# EAGLE design PCB Design (EAGLE 8.6.3)
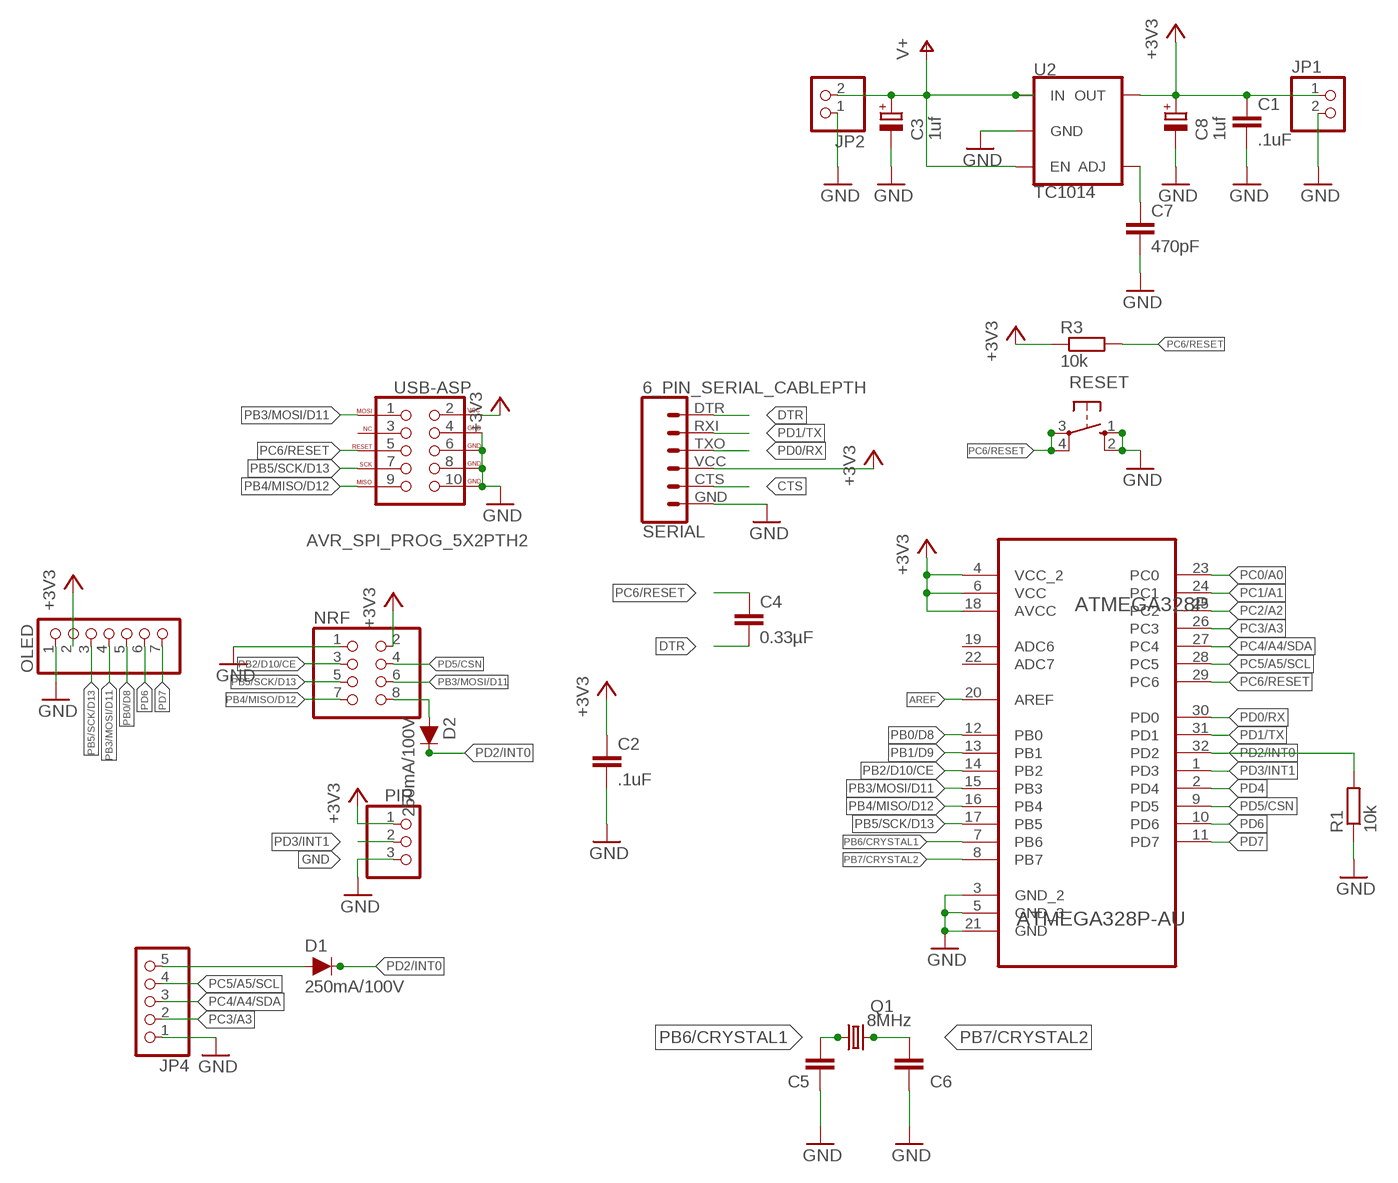
[diagram p0: schematic, sheet 1]

## Parts
ATMEGA328P  ATMEGA328P-AU  [QFP80P900X900X120-32N]
C1  .1uF  C-EUC0805K  [C0805K]
C2  .1uF  C-EUC0805K  [C0805K]
C3  1uf  CPOL-EUE2.5-5  [E2,5-5]
C4  0.33µF  C-EUC0805K  [C0805K]
C5  22pF  C-EUC0805K  [C0805K]
C6  22pF  C-EUC0805K  [C0805K]
C7  470pF  C-EUC0805K  [C0805K]
C8  1uf  CPOL-EUE2.5-5  [E2,5-5]
D1  250mA/100V  DIODE-BAS16J  [SOD-323]
D2  250mA/100V  DIODE-BAS16J  [SOD-323]
JP1  PINHD-1X2  [1X02]
JP2  PINHD-1X2  [1X02]
JP4  PINHD-1X5  [1X05]
NRF  PINHD-2X4  [2X04]
OLED  PINHD-1X7  [1X07]
PIR  PINHD-1X3  [1X03]
Q1  8MHz  CRYSTALHC49U70  [HC49U70]
R1  10k  R-EU_M0805  [M0805]
R3  10k  R-EU_M0805  [M0805]
RESET  10-XX  [B3F-10XX]
SERIAL  6_PIN_SERIAL_CABLEPTH  [FTDI_BASIC]
U2  TC1014  AP2202-ADJ  [SOT23-5]
USB-ASP  AVR_SPI_PROG_5X2PTH2  [2X5-SHROUDED]

## Nets
8: D2.A NRF.8
+3V3: ATMEGA328P.4(VCC_2) ATMEGA328P.6(VCC) ATMEGA328P.18(AVCC) C1.1 C2.1 C8.+ JP1.1 NRF.2 OLED.2 PIR.1 R3.1 SERIAL.VCC U2.5(OUT) USB-ASP.2(VCC)
AREF: ATMEGA328P.20(AREF)
BYPASS: C7.1 U2.4(ADJ)
CTS: SERIAL.CTS
DTR: C4.2 SERIAL.DTR
GND: ATMEGA328P.3(GND_2) ATMEGA328P.5(GND_3) ATMEGA328P.21(GND) C1.2 C2.2 C3.- C5.1 C6.1 C7.2 C8.- JP1.2 JP2.1 JP4.1 NRF.1 OLED.1 PIR.3 R1.1 RESET.1(S) RESET.2(S1) SERIAL.GND U2.2(GND) USB-ASP.4(GND) USB-ASP.6(GND) USB-ASP.8(GND) USB-ASP.10(GND)
N$6: D1.A JP4.5
PB0/D8: ATMEGA328P.12(PB0) OLED.5
PB1/D9: ATMEGA328P.13(PB1)
PB2/D10/CE: ATMEGA328P.14(PB2) NRF.3
PB3/MOSI/D11: ATMEGA328P.15(PB3) NRF.6 OLED.4 USB-ASP.1(MOSI)
PB4/MISO/D12: ATMEGA328P.16(PB4) NRF.7 USB-ASP.9(MISO)
PB5/SCK/D13: ATMEGA328P.17(PB5) NRF.5 OLED.3 USB-ASP.7(SCK)
PB6/CRYSTAL1: ATMEGA328P.7(PB6) C5.2 Q1.1
PB7/CRYSTAL2: ATMEGA328P.8(PB7) C6.2 Q1.2
PC0/A0: ATMEGA328P.23(PC0)
PC1/A1: ATMEGA328P.24(PC1)
PC2/A2: ATMEGA328P.25(PC2)
PC3/A3: ATMEGA328P.26(PC3) JP4.2
PC4/A4/SDA: ATMEGA328P.27(PC4) JP4.3
PC5/A5/SCL: ATMEGA328P.28(PC5) JP4.4
PC6/RESET: ATMEGA328P.29(PC6) C4.1 R3.2 RESET.3(P) RESET.4(P1) USB-ASP.5(RESET)
PD0/RX: ATMEGA328P.30(PD0) SERIAL.TXO
PD1/TX: ATMEGA328P.31(PD1) SERIAL.RXI
PD2/INT0: ATMEGA328P.32(PD2) D1.C D2.C R1.2
PD3/INT1: ATMEGA328P.1(PD3) PIR.2
PD4: ATMEGA328P.2(PD4)
PD5/CSN: ATMEGA328P.9(PD5) NRF.4
PD6: ATMEGA328P.10(PD6) OLED.6
PD7: ATMEGA328P.11(PD7) OLED.7
V+: C3.+ JP2.2 U2.1(IN) U2.3(EN)
Unconnected: ATMEGA328P.19(ADC6) ATMEGA328P.22(ADC7) USB-ASP.3(NC)

## Library data of the parts
ATMEGA328P = Atmel_By_element14_Batch_1-00:ATMEGA328P-AU: 8-bit Microcontroller with In-System Programmable Flash; MF: MICROCHIP; MPN: ATMEGA328P-AU; OC_FARNELL: 1715486; OC_NEWARK: 14R4631; PACKAGE: TQFP-32; SUPPLIER: Atmel
C1 C2 C4-C7 = rcl:C-EU: CAPACITOR, European symbol; OC_FARNELL: unknown; SPICEPREFIX: C
C3 C8 = rcl:CPOL-EU: POLARIZED CAPACITOR, European symbol; OC_FARNELL: unknown; SPICEPREFIX: C
D1 D2 = SparkFun-DiscreteSemi:DIODE: Diode These are standard reverse protection diodes and small signal diodes. SparkFun Products: SparkFun SparkPunk Sound Kit <https://www.sparkfun.com/products/11177> SparkFun ESP8266 Thing <https://www.sparkfun.com/products/13231>; MF: SCHMERSAL; MPN: BNS33-11ZG-3M; OC_FARNELL: 1890445; PROD_ID: DIO-09646
JP1 JP2 = pinhead:PINHD-1X2: PIN HEADER; OC_FARNELL: unknown
JP4 = pinhead:PINHD-1X5: PIN HEADER; OC_FARNELL: unknown
NRF = pinhead:PINHD-2X4: PIN HEADER; OC_FARNELL: unknown
OLED = pinhead:PINHD-1X7: PIN HEADER; OC_FARNELL: unknown
PIR = pinhead:PINHD-1X3: PIN HEADER; OC_FARNELL: unknown
Q1 = crystal:CRYSTAL: CRYSTAL; OC_FARNELL: unknown; OC_NEWARK: unknown
R1 R3 = resistor:R-EU_: RESISTOR, European symbol; OC_FARNELL: unknown
RESET = switch-omron:10-XX: OMRON SWITCH; MF: OMRON ELECTRONIC COMPONENTS; MPN: B3F-1000; OC_FARNELL: 176432; OC_NEWARK: 36M3542
SERIAL = SparkFun-Connectors:6_PIN_SERIAL_CABLE: 6-pin header connection for use with the "FTDI BASIC" pinout - CABLE SIDE. Also known as "Arduino Serial Program Header". This is used on a design to provide a 6-pin connection point for serial communication usually from a USB cable (D+/D-) to these headers (RX/TX). It also has the remaining pins necessary for programming in the Arduino evironment (DTR, GND, and sometimes VCC). Note, this device has "CABLE" in the name. It is intended to be used on a design that usually lives on the end of your USB cable and prvides the converter chip (FTDI232 or FTDI231x) to commnicate serial RX/TX. The "sister" device, named "TARGET" is inteneded to be used on a design that contains a target micro-controller that you wish to program. You can populate with some of these: Female Headers <https://www.sparkfun.com/products/115> (PRT-00115) For reference (or to suit your programming needs) check out these designs: SparkFun FTDI Basic Breakout - 5V <https://www.sparkfun.com/products/9716> (DEV-09716) SparkFun FTDI Basic Breakout - 3.3V <https://www.sparkfun.com/products/9873> (DEV-09873) SparkFun FTDI SmartBasic <https://www.sparkfun.com/products/12935> (DEV-12935) SparkFun Beefy 3 - FTDI Basic Breakout <https://www.sparkfun.com/products/13746> (DEV-13746); OC_FARNELL: unknown
U2 = SparkFun-IC-Power:AP2202-ADJ: AP2202 Adjustable LDO Diodes Inc small, low-cost LDO 150mA, 13.2V, less than 200mV dropout; OC_FARNELL: unknown; PROD_ID: VREG-12189; VALUE: AP2202-ADJ
USB-ASP = SparkFun-Connectors:AVR_SPI_PROG_5X2: AVR 10-pin ICSP Header This is the standard AVR In Circuit Serial Programming header. Minimal, but includes pin one indicator. Works with standard Olimex programmers. SparkFun Products: 2x5 AVR ICSP Male Header <https://www.sparkfun.com/products/778> - PTH 2x5 Pin Shrouded Header <https://www.sparkfun.com/products/8506> - PTH2; OC_FARNELL: unknown; PROD_ID: CONN-08671; SF_ID: PRT-08506

## Board
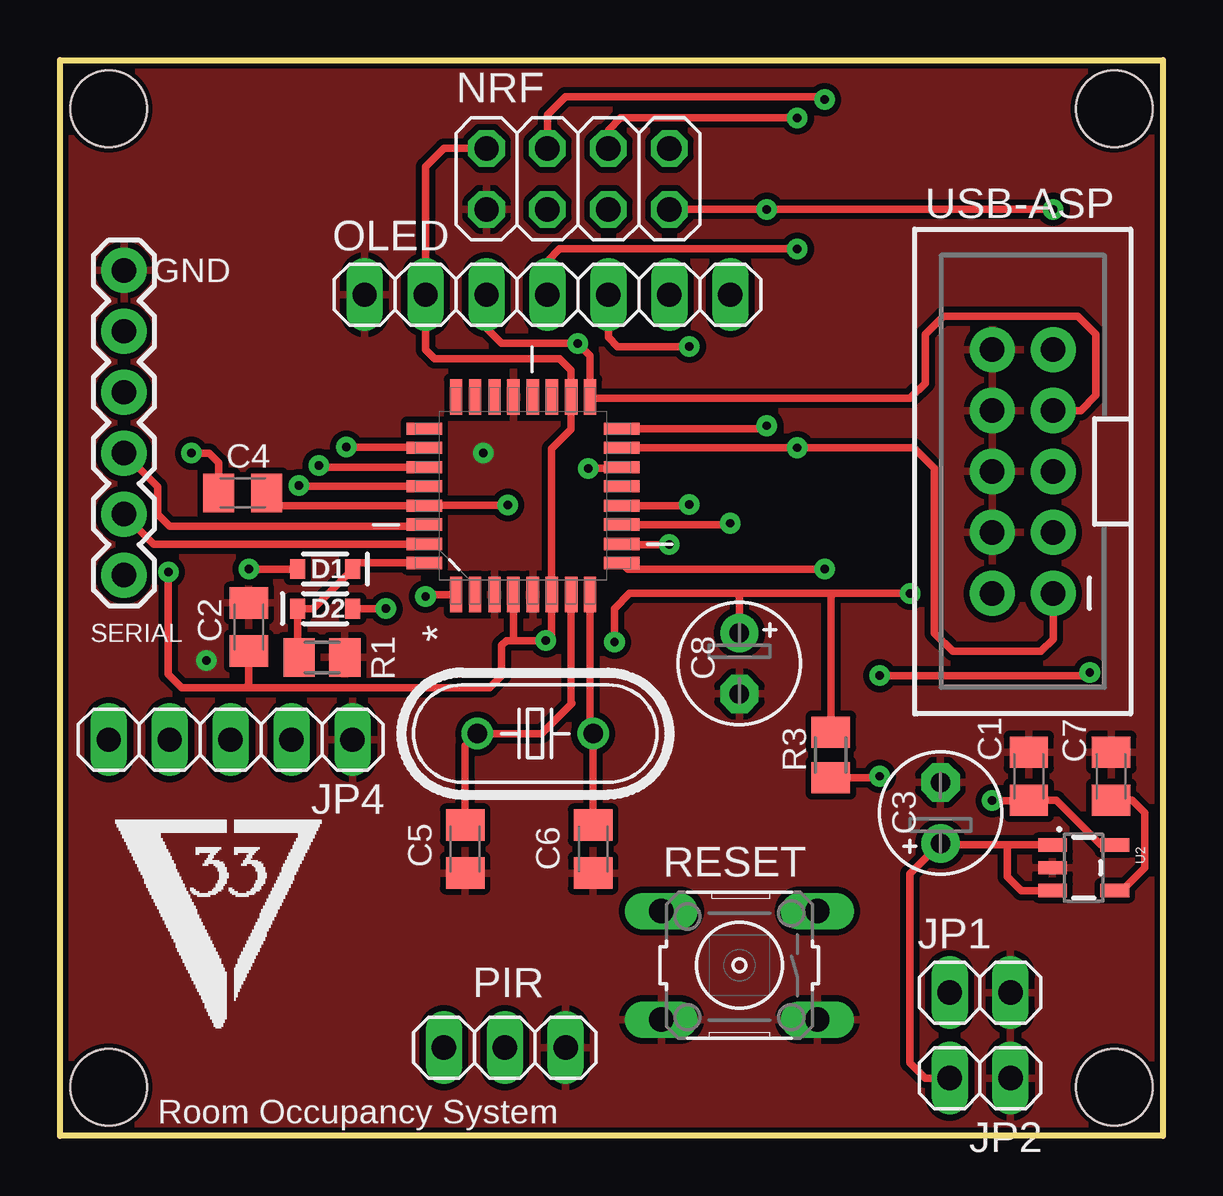
[diagram p1: board, top side]
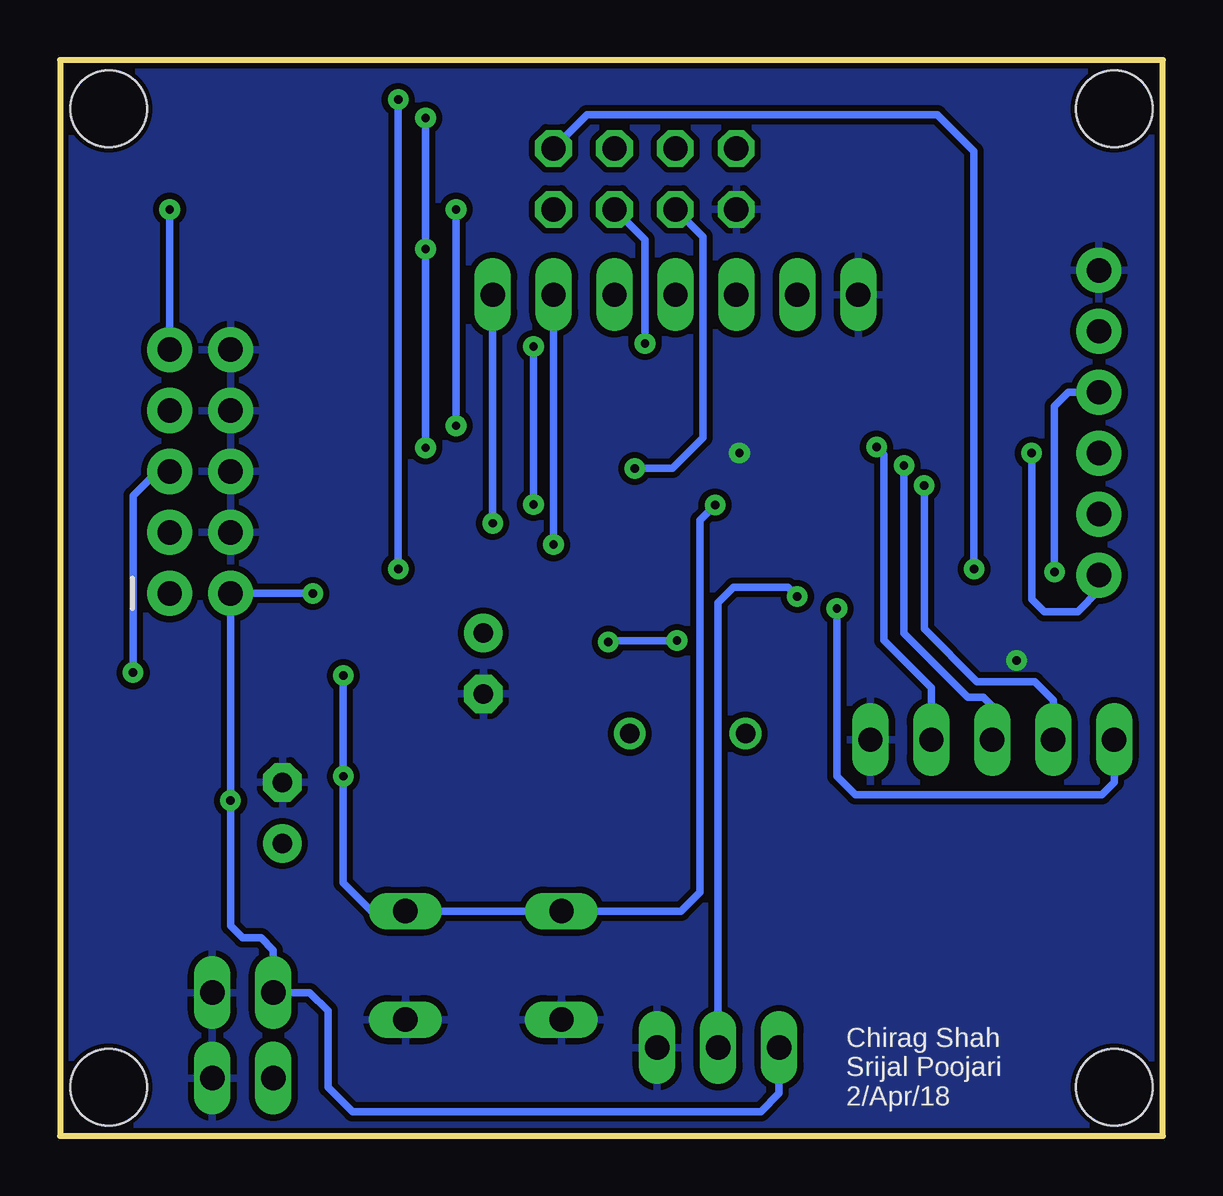
[diagram p2: board, bottom side, seen from below]

Size 45.97 x 44.83 mm. Coordinates in mm from the lower left corner, seen from the top.
Outline: 45.97,0 0,0 0,44.83 45.97,44.83 45.97,0
Copper layers (1*16): Top 0.035mm / dielectric 1.5mm / Bottom 0.035mm
Design rules "SparkFun-2-layer-STANDARD *": minimum track width 10mil, minimum drill 12mil, track to track 10mil, track to pad 8mil, pad to pad 8mil, via to via 10mil, smd to smd 8mil, copper to edge 8mil, drill to drill 8mil, minimum pad ring 10mil, minimum via ring 10mil, stop-mask expansion 4mil, vias tented up to drill 25mil, thermal gap 10mil
Holes 3.2 mm at 43.94,42.8 2.03,42.8 43.94,2.03 2.03,2.03

### Footprints (pad centres in the part's own frame; a part is rotated, then mirrored left to right if it is on the bottom)
QFP80P900X900X120-32N = smd 1.473 x 0.508: 1 -4.115,2.794; 2 -4.115,2.007; 3 -4.115,1.194; 4 -4.115,0.406; 5 -4.115,-0.406; 6 -4.115,-1.194; 7 -4.115,-2.007; 8 -4.115,-2.794; 17 4.115,-2.794; 18 4.115,-2.007; 19 4.115,-1.194; 20 4.115,-0.406; 21 4.115,0.406; 22 4.115,1.194; 23 4.115,2.007; 24 4.115,2.794 | smd 0.508 x 1.473: 9 -2.794,-4.115; 10 -2.007,-4.115; 11 -1.194,-4.115; 12 -0.406,-4.115; 13 0.406,-4.115; 14 1.194,-4.115; 15 2.007,-4.115; 16 2.794,-4.115; 25 2.794,4.115; 26 2.007,4.115; 27 1.194,4.115; 28 0.406,4.115; 29 -0.406,4.115; 30 -1.194,4.115; 31 -2.007,4.115; 32 -2.794,4.115
C0805K = smd 1.3 x 1.6: 1 -1,0; 2 1,0
E2,5-5 = drill 0.813 pad 1.6: + -1.27,0 | drill 0.813 pad 1.6 octagon: - 1.27,0
SOD-323 = smd 0.63 x 0.83: A 1.15,0; C -1.15,0
1X02 = drill 1.016 long: 1 -1.27,0; 2 1.27,0
1X05 = drill 1.016 long: 1 -5.08,0; 2 -2.54,0; 3 0,0; 4 2.54,0; 5 5.08,0
2X04 = drill 1.016 octagon: 1 -3.81,-1.27; 2 -3.81,1.27; 3 -1.27,-1.27; 4 -1.27,1.27; 5 1.27,-1.27; 6 1.27,1.27; 7 3.81,-1.27; 8 3.81,1.27
1X07 = drill 1.016 long: 1 -7.62,0; 2 -5.08,0; 3 -2.54,0; 4 0,0; 5 2.54,0; 6 5.08,0; 7 7.62,0
1X03 = drill 1.016 long: 1 -2.54,0; 2 0,0; 3 2.54,0
HC49U70 = drill 0.813: 1 -2.413,0; 2 2.413,0
M0805 = smd 1.3 x 1.6: 1 -0.95,0; 2 0.95,0
B3F-10XX = drill 1.016 long: 1 -3.251,2.261; 2 3.251,2.261; 3 -3.251,-2.261; 4 3.251,-2.261
FTDI_BASIC = drill 1.016 pad 1.88: CTS 10.16,0; DTR 0,0; GND 12.7,0; RXI 2.54,0; TXO 5.08,0; VCC 7.62,0
SOT23-5 = smd 0.55 x 1.2: 1 -0.95,-1.3; 2 0,-1.3; 3 0.95,-1.3; 4 0.95,1.3; 5 -0.95,1.3
2X5-SHROUDED = drill 1.016 pad 1.88: 1 -1.27,5.08; 2 1.27,5.08; 3 -1.27,2.54; 4 1.27,2.54; 5 -1.27,0; 6 1.27,0; 7 -1.27,-2.54; 8 1.27,-2.54; 9 -1.27,-5.08; 10 1.27,-5.08

### Placement (x,y rotation side)
ATMEGA328P  19.3,26.67 90 top
C1  40.39,14.99 90 top
C2  7.87,21.21 90 top
C3  36.7,13.46 90 top
C4  7.62,26.8 180 top
C5  16.89,11.95 90 top
C6  22.23,11.95 90 top
C7  43.81,14.99 90 top
C8  28.32,19.69 270 top
D1  11.05,21.97 0 top
D2  11.05,23.62 180 top
JP1  38.35,5.97 0 top
JP2  38.35,2.41 180 top
JP4  7.11,16.51 180 top
NRF  21.59,39.88 0 top
OLED  20.32,35.05 0 top
PIR  18.54,3.68 0 top
Q1  19.81,16.76 0 top
R1  10.92,19.94 180 top
R3  32.13,15.88 270 top
RESET  28.32,7.11 180 top
SERIAL  2.67,23.37 90 top
U2  42.67,11.18 270 top
USB-ASP  40.13,27.69 180 top

### Tracks (layer width: path | path; a pad name or v marks a point on that pad's centre or on a via)
8  (via drill 0.35)
  Top 0.305: D2.A v7.87,23.62
  Bottom 0.305: NRF.8 24,42.54 9.4,42.54 7.87,41.02 v7.87,23.62
+3V3  (via drill 0.35)
  Top 0.305: ATMEGA328P.6 20.57,22.63 | 4.63,23.38 v4.52,23.5 4.52,19.23 5.08,18.67 7.75,18.67 | NRF.2 16,41.15 15.24,40.39 OLED.2 15.24,32.77 15.62,32.38 20.83,32.38 21.31,31.9 ATMEGA328P.18 21.31,29.44 20.5,28.63 ATMEGA328P.6 | ATMEGA328P.6 20.5,20.88 v20.26,20.64 | 20.19,20.57 v20.26,20.64 | 35.18,22.61 v35.43,22.61 32.26,22.61 | v23.11,20.57 23.11,21.97 23.75,22.61 28.19,22.61 | 28.19,22.61 32.26,22.61 | 32.26,22.61 32.13,22.48 R3.1 | C8.+ 28.32,22.48 28.19,22.61 | 7.75,18.67 17.91,18.67 18.41,19.18 18.41,20.45 18.61,20.64 18.92,20.64 | v20.26,20.64 18.92,20.64 | ATMEGA328P.4 18.9,20.66 18.92,20.64 | U2.5 43.39,12.13 41.53,13.99 C1.1 40.37,13.97 v38.86,13.97 | C2.1 7.87,18.8 7.75,18.67
  Bottom 0.305: SERIAL.VCC 3.94,30.99 4.52,30.41 v4.52,23.5 | v20.26,20.64 23.05,20.64 v23.11,20.57 | v35.43,22.61 USB-ASP.2 v38.86,13.97 38.86,8.76 38.35,8.26 37.59,8.26 37.08,7.75 JP1.1 35.56,5.97 34.8,5.21 34.8,2.03 33.78,1.02 16.76,1.02 16,1.78 PIR.1
BYPASS
  Top 0.305: U2.4 44.26,10.23 45.21,11.18 45.21,13.46 44.69,13.99 C7.1
DTR  (via drill 0.35)
  Top 0.254: 6.48,26.8 C4.2
  Top 0.305: C4.2 6.62,28.05 6.22,28.45 v5.48,28.45
  Bottom 0.305: SERIAL.DTR 2.67,22.73 3.56,21.84 4.95,21.84 5.46,22.35 5.46,26.42 5.46,26.69 5.46,28.43 v5.48,28.45
GND  (via drill 0.35)
  other vias: 17.65,28.45 6.1,19.81
  pour Bottom: 45.47,0.38 0.51,0.38 0.51,44.32 45.47,44.32
  pour Top: 45.47,44.32 0.51,44.32 0.51,0.38 45.47,0.38
N$6  (via drill 0.35)
  Top 0.305: D1.A v13.59,21.97
  Bottom 0.305: v13.59,21.97 13.59,14.99 12.83,14.22 2.54,14.22 2.03,14.73 JP4.5
PB0/D8  (via drill 0.35)
  Top 0.305: ATMEGA328P.12 26.19,26.26 v26.23,26.31 | OLED.5 22.86,33.27 23.24,32.89 v26.23,32.89
  Bottom 0.305: v26.23,26.31 v26.23,32.89
PB2/D10/CE  (via drill 0.35)
  Top 0.305: ATMEGA328P.14 23.37,27.81 v22.02,27.81
  Bottom 0.305: NRF.3 19.18,37.46 19.18,29.08 20.45,27.81 v22.02,27.81
PB3/MOSI/D11  (via drill 0.35)
  Top 0.305: OLED.4 20.32,36.45 20.83,36.96 v30.73,36.96 | NRF.6 22.86,41.91 23.37,42.42 v30.73,42.42 | ATMEGA328P.15 v30.73,28.68 35.59,28.68 36.45,27.81 36.45,20.96 37.21,20.19 40.89,20.19 41.4,20.7 USB-ASP.1
  Bottom 0.305: v30.73,42.42 v30.73,36.96 v30.73,28.68
PB4/MISO/D12  (via drill 0.35)
  Top 0.305: NRF.7 v29.46,38.61 v41.4,38.61 | ATMEGA328P.16 29.46,29.46 v29.46,29.59
  Bottom 0.305: 29.46,29.46 v29.46,29.59 v29.46,38.61 | v41.4,38.61 USB-ASP.9
PB5/SCK/D13  (via drill 0.35)
  Top 0.305: USB-ASP.7 42.55,30.23 43.18,30.86 43.18,33.4 42.42,34.16 36.83,34.16 36.07,33.4 36.07,31.37 35.43,30.73 22.15,30.73 ATMEGA328P.17 22.1,32.51 v21.59,33.02 18.41,33.02 17.78,33.66 OLED.3
  Bottom 0.305: NRF.5 21.59,37.34 v21.59,33.02
PB6/CRYSTAL1
  Top 0.305: ATMEGA328P.7 21.31,18.06 21.34,18.03 20.07,16.76 Q1.1 16.89,16.26 C5.2
PB7/CRYSTAL2
  Top 0.305: ATMEGA328P.8 22.1,16.89 Q1.2 C6.2
PC3/A3  (via drill 0.35)
  Top 0.305: v11.94,28.7 15.17,28.7 ATMEGA328P.26
  Bottom 0.305: JP4.2 9.65,18.67 11.63,20.65 11.63,28.39 v11.94,28.7
PC4/A4/SDA  (via drill 0.35)
  Top 0.305: ATMEGA328P.27 10.87,27.86 v10.8,27.94
  Bottom 0.305: JP4.3 7.11,17.91 7.49,18.29 8.13,18.29 10.8,20.96 v10.8,27.94
PC5/A5/SCL  (via drill 0.35)
  Top 0.305: ATMEGA328P.28 9.98,27.08 v9.95,27.1
  Bottom 0.305: v9.95,27.1 9.95,21.13 7.75,18.92 5.33,18.92 4.57,18.16 JP4.4
PC6/RESET  (via drill 0.35)
  Top 0.305: ATMEGA328P.29 14.99,26.26 15.01,26.29 v18.67,26.29 | R3.2 34.1,14.92 v34.16,14.99 | 15.16,26.29 ATMEGA328P.29 | ATMEGA328P.29 9.15,26.26 C4.1 | v42.93,19.3 42.8,19.18 v34.16,19.18
  Bottom 0.305: v18.67,26.29 19.3,25.65 19.3,10.16 20.09,9.37 RESET.4 RESET.3 32.99,9.37 34.16,10.54 v34.16,14.99 v34.16,19.18 | USB-ASP.5 41.91,27.69 42.93,26.67 v42.93,19.3
PD0/RX
  Top 0.305: SERIAL.TXO 4.06,27.05 4.06,25.91 4.57,25.4 15.11,25.4 ATMEGA328P.30
PD1/TX
  Top 0.305: SERIAL.RXI 3.91,24.66 ATMEGA328P.31
PD2/INT0
  Top 0.305: ATMEGA328P.32 12.45,23.88 D2.C 10.55,21.97 D1.C 9.9,20.01 R1.2
PD3/INT1  (via drill 0.35)
  Top 0.305: v15.24,22.48 15.32,22.56 ATMEGA328P.1
  Bottom 0.305: PIR.2 18.54,22.23 17.91,22.86 15.62,22.86 v15.24,22.48
PD5/CSN  (via drill 0.35)
  Top 0.305: ATMEGA328P.9 23.67,23.62 v31.88,23.62 | NRF.4 20.32,42.54 21.08,43.31 31.75,43.31 v31.88,43.18
  Bottom 0.305: v31.88,43.18 v31.88,23.62
PD6  (via drill 0.35)
  Top 0.305: v25.4,24.64 23.44,24.64 ATMEGA328P.10
  Bottom 0.305: OLED.6 v25.4,24.64
PD7  (via drill 0.35)
  Top 0.305: ATMEGA328P.11 27.89,25.48 v27.94,25.53
  Bottom 0.305: v27.94,25.53 OLED.7
V+
  Top 0.305: U2.1 39.5,12.13 | 39.5,12.13 36.77,12.13 C3.+ 35.43,10.92 35.43,3.05 36.07,2.41 JP2.2 | U2.3 40.07,10.23 39.5,10.79 39.5,12.13

### Text on the board
tPlace: GND | Room Occupancy System
bPlace: Chirag Shah / Srijal Poojari / 2/Apr/18